# Altium schematic sheet Test_Jig_Pixhawk_DUT.SchDoc
size A2; DrawnBy: Philip Rowse
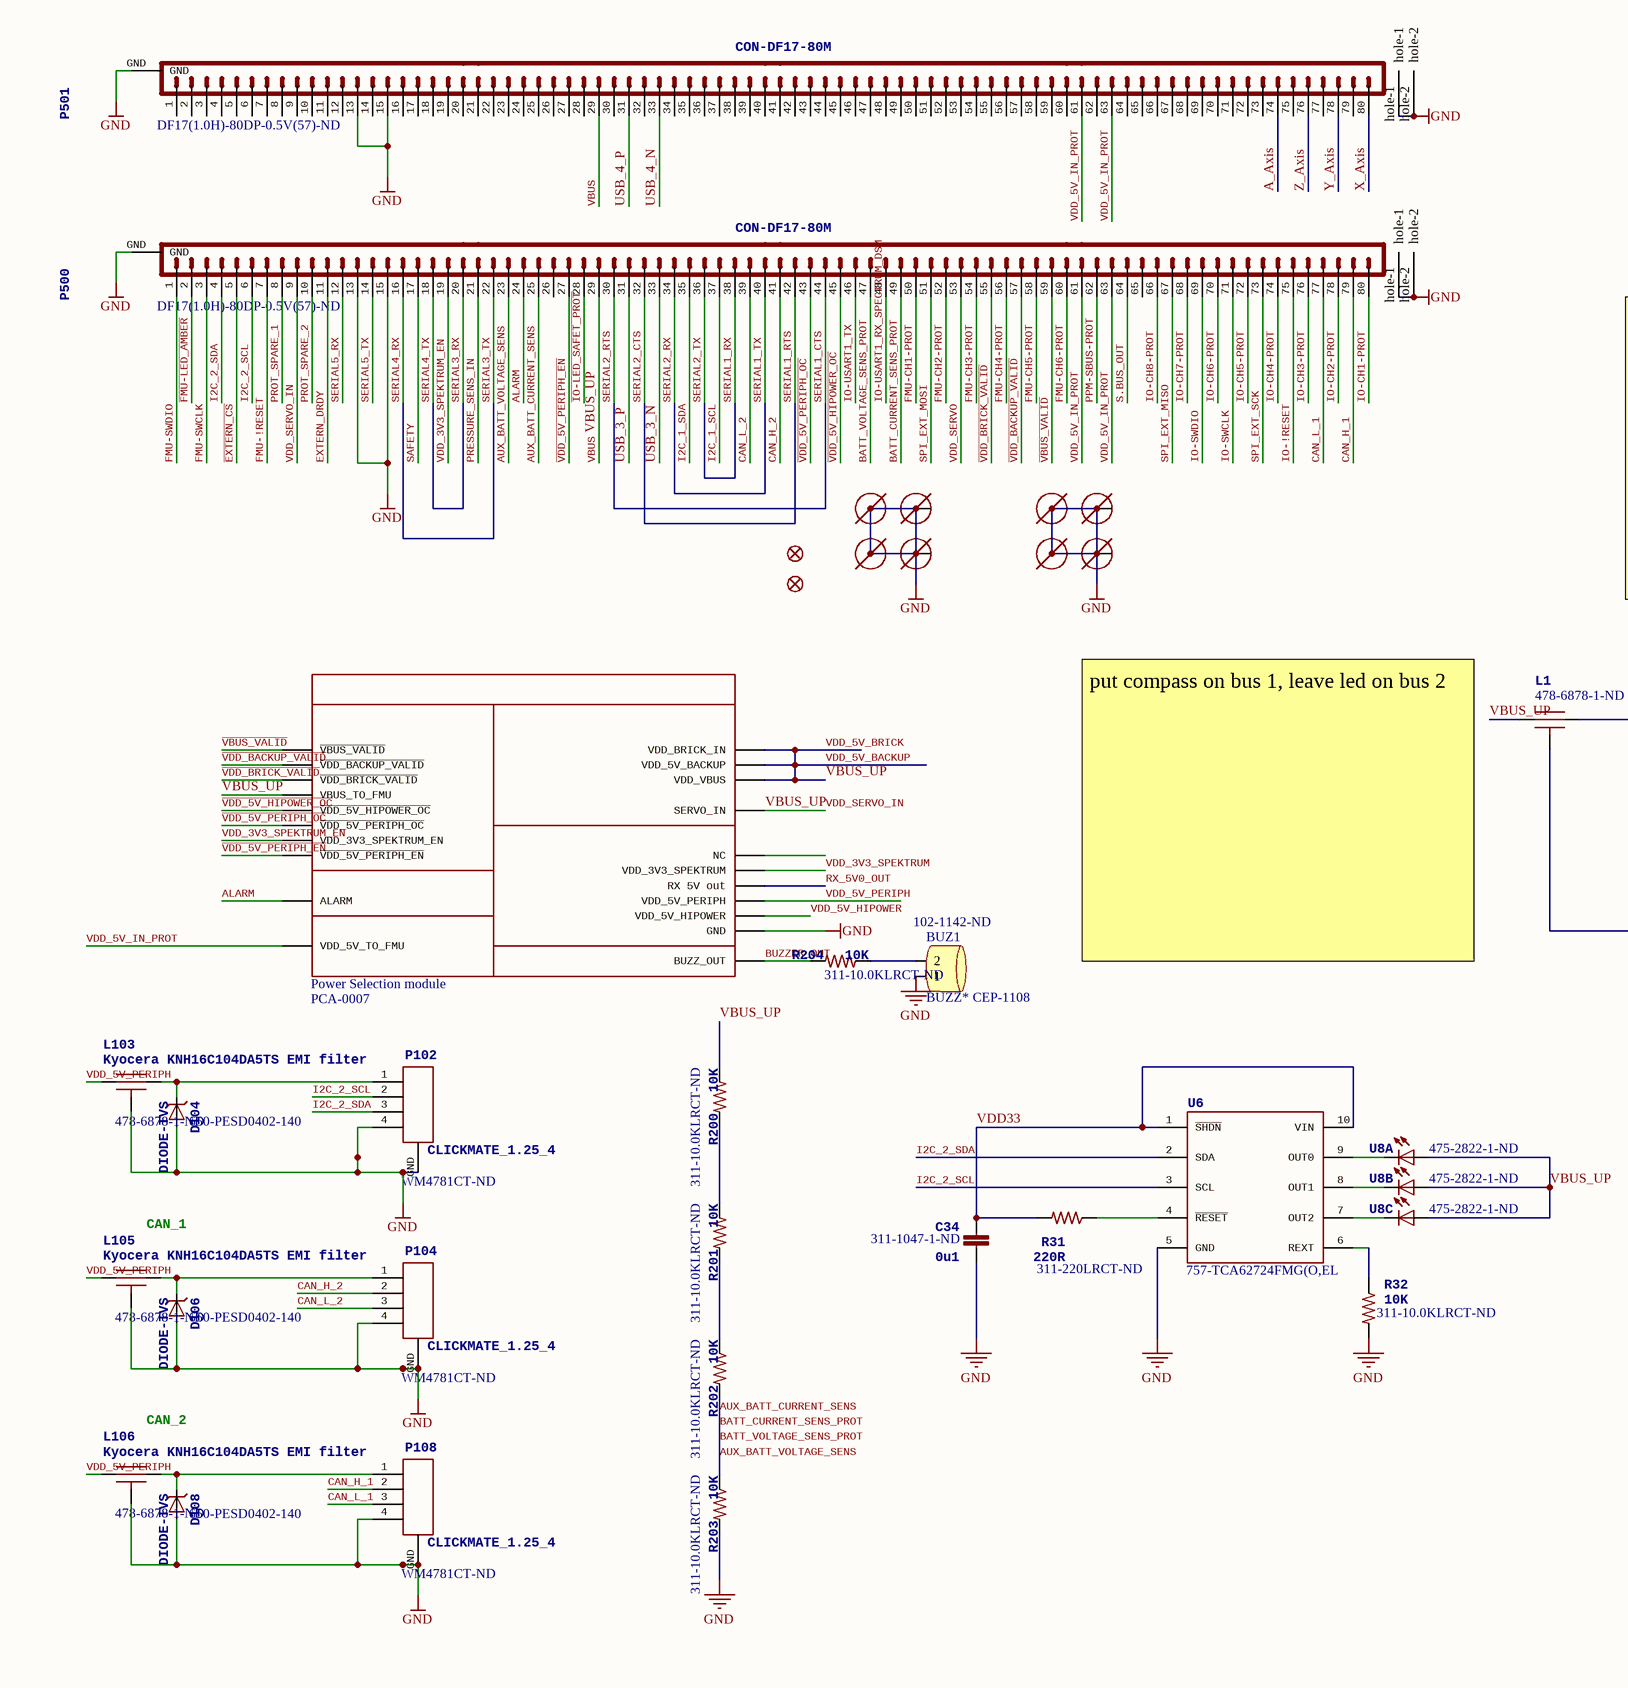
[diagram p0: Test_Jig_Pixhawk_DUT.SchDoc, left]
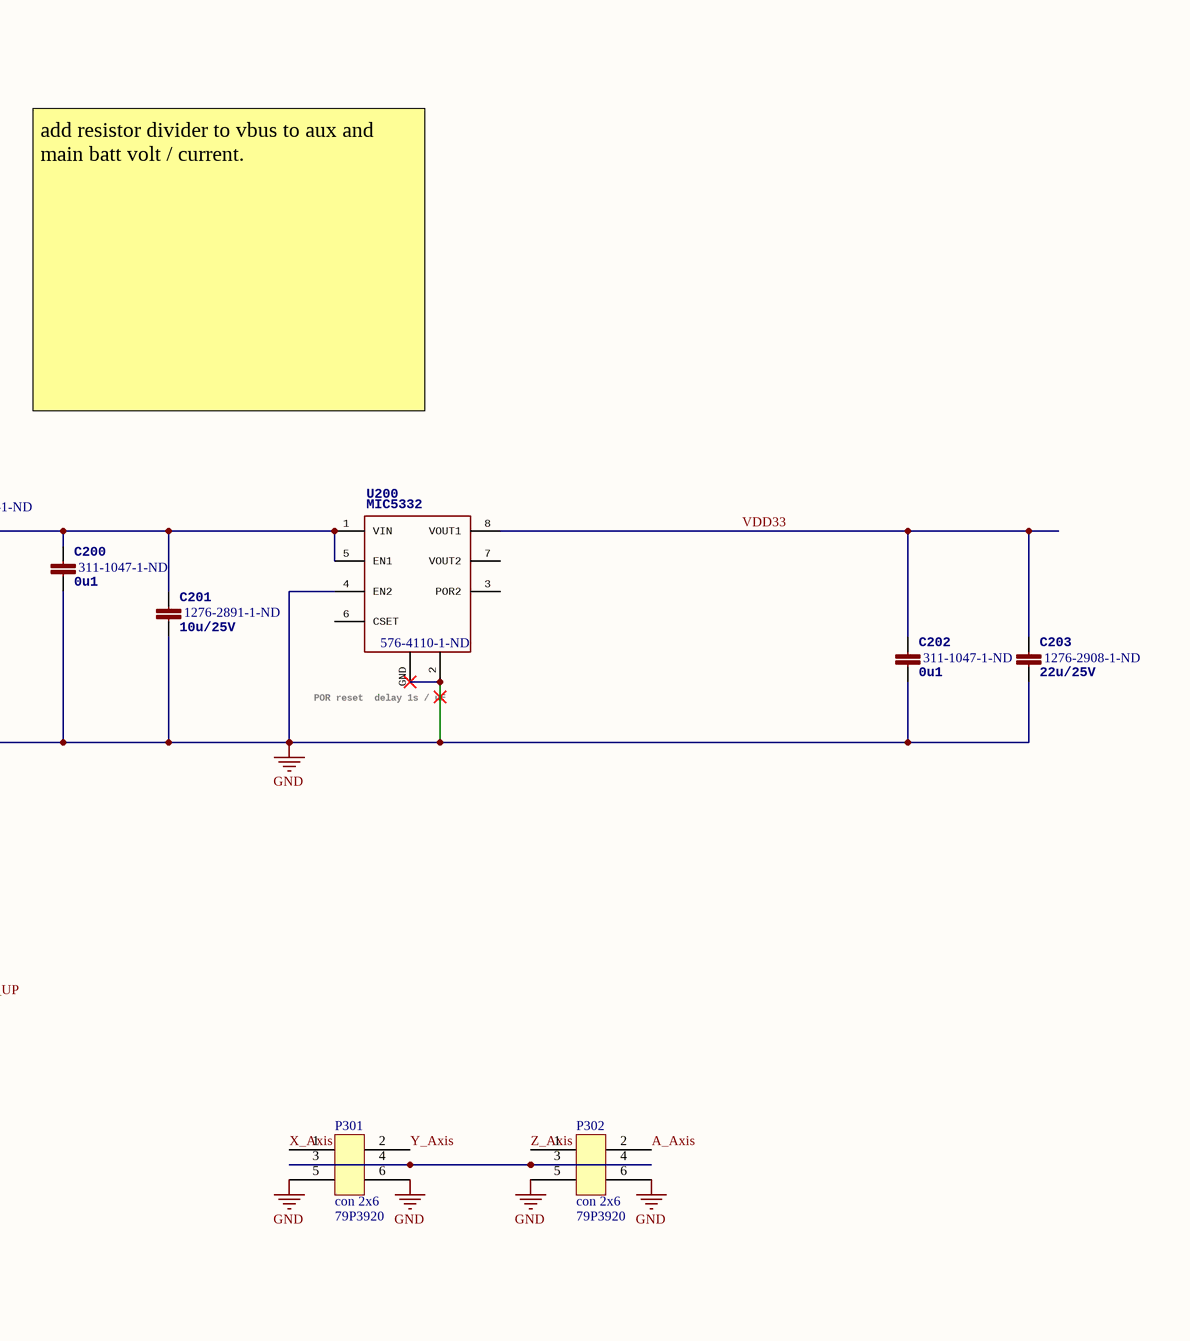
[diagram p1: Test_Jig_Pixhawk_DUT.SchDoc, right]

## Parts
BUZ1  BUZZ* CEP-1108  Supplier Part Number 1: 102-1142-ND  [CEP-1108]
C34  0u1  Supplier Part Number 1: 311-1047-1-ND  [0402-CAP]
C200  0u1  Supplier Part Number 1: 311-1047-1-ND  [0402-CAP]
C201  10u/25V  Supplier Part Number 1: 1276-2891-1-ND  [0805-CAP]
C202  0u1  Supplier Part Number 1: 311-1047-1-ND  [0402-CAP]
C203  22u/25V  Supplier Part Number 1: 1276-2908-1-ND  [0805-CAP]
D104  DIODE-TVS  Supplier Part Number 1: 650-PESD0402-140  [0402-TVS]
D106  DIODE-TVS  Supplier Part Number 1: 650-PESD0402-140  [0402-TVS]
D108  DIODE-TVS  Supplier Part Number 1: 650-PESD0402-140  [0402-TVS]
JP400  FIDUCIAL1.5X3  [FIDUCIAL-1.5X3]  (value not drawn)
JP401  FIDUCIAL1.5X3  [FIDUCIAL-1.5X3]  (value not drawn)
L1  Supplier Part Number 1: 478-6878-1-ND  [KYOCERA-KNH16-DA]  (hidden comment: Kyocera KNH16C104DA5TS EMI filter)
L103  Kyocera KNH16C104DA5TS EMI filter  Supplier Part Number 1: 478-6878-1-ND  [KYOCERA-KNH16-DA]
L105  Kyocera KNH16C104DA5TS EMI filter  Supplier Part Number 1: 478-6878-1-ND  [KYOCERA-KNH16-DA]
L106  Kyocera KNH16C104DA5TS EMI filter  Supplier Part Number 1: 478-6878-1-ND  [KYOCERA-KNH16-DA]
M3_MOUNT901  MOUNT-HOLE1.8MM  [MOUNT-HOLE1.8]  (value not drawn)
M3_MOUNT902  MOUNT-HOLE1.8MM  [MOUNT-HOLE1.8]  (value not drawn)
M3_MOUNT903  MOUNT-HOLE1.8MM  [MOUNT-HOLE1.8]  (value not drawn)
M3_MOUNT904  MOUNT-HOLE1.8MM  [MOUNT-HOLE1.8]  (value not drawn)
M3_MOUNT911  MOUNT-HOLE1.8MM  [MOUNT-HOLE1.8]  (value not drawn)
M3_MOUNT912  MOUNT-HOLE1.8MM  [MOUNT-HOLE1.8]  (value not drawn)
M3_MOUNT913  MOUNT-HOLE1.8MM  [MOUNT-HOLE1.8]  (value not drawn)
M3_MOUNT914  MOUNT-HOLE1.8MM  [MOUNT-HOLE1.8]  (value not drawn)
P102  CLICKMATE_1.25_4  Supplier Part Number 1: WM4781CT-ND  [CLICKMATE_V4]
P104  CLICKMATE_1.25_4  Supplier Part Number 1: WM4781CT-ND  [CLICKMATE_V4]
P108  CLICKMATE_1.25_4  Supplier Part Number 1: WM4781CT-ND  [CLICKMATE_V4]
P301  con 2x6  Supplier Part Number 1: 79P3920  [TSW-103-07-G-D]
P302  con 2x6  Supplier Part Number 1: 79P3920  [TSW-103-07-G-D]
P500  CON-DF17-80M  Supplier Part Number 1: DF17(1.0H)-80DP-0.5V(57)-ND  [CON-DF17-80M]
P501  CON-DF17-80M  Supplier Part Number 1: DF17(1.0H)-80DP-0.5V(57)-ND  [CON-DF17-80M]
PSM200  Power Selection module  Supplier Part Number 1: PCA-0007  [PSM]
R31  220R  Supplier Part Number 1: 311-220LRCT-ND  [0402-RES]
R32  10K  Supplier Part Number 1: 311-10.0KLRCT-ND  [0402-RES]
R200  10K  Supplier Part Number 1: 311-10.0KLRCT-ND  [0402-RES]
R201  10K  Supplier Part Number 1: 311-10.0KLRCT-ND  [0402-RES]
R202  10K  Supplier Part Number 1: 311-10.0KLRCT-ND  [0402-RES]
R203  10K  Supplier Part Number 1: 311-10.0KLRCT-ND  [0402-RES]
R204  10K  Supplier Part Number 1: 311-10.0KLRCT-ND  [0402-RES]
U6  Supplier Part Number 1: 757-TCA62724FMG(O,EL  [SON10]  (hidden comment: TCA62724FMG)
U8  Supplier Part Number 1: 475-2822-1-ND  [6-PLCC]  (hidden comment: LRTB GFTG-T7AW-1+V7A7-29+R5T9-49-L)  (parts A,B,C of 3)
U200  MIC5332  Supplier Part Number 1: 576-4110-1-ND  [MLF-8-EPAD]

## Nets
GND: BUZ1.1 C34.P$1 C200.P$2 C201.P$2 C202.P$2 C203.P$2 D104.A D106.A D108.A L1.GND L103.GND L105.GND L106.GND M3_MOUNT901.1 M3_MOUNT902.1 M3_MOUNT903.1 M3_MOUNT904.1 M3_MOUNT911.1 M3_MOUNT912.1 M3_MOUNT913.1 M3_MOUNT914.1 P102.4 P102.GND P104.4 P104.GND P108.4 P108.GND P301.5 P301.6 P302.5 P302.6 P500.13 P500.15 P500.GND P500.hole-1 P500.hole-2 P501.13 P501.15 P501.GND P501.hole-1 P501.hole-2 PSM200.GND R32.P$2 R203.P$2 U6.5(GND) U200.2(GND) U200.4(EN2) U200.GND
A_Axis: P302.2 P501.74
ALARM: P500.24 PSM200.ALARM
AUX_BATT_CURRENT_SENS: P500.23 P500.25 P500.47 P500.49 R202.P$2 R203.P$1  [also labelled AUX_BATT_VOLTAGE_SENS, BATT_CURRENT_SENS_PROT, BATT_VOLTAGE_SENS_PROT]
BUZZER_OUT: PSM200.BUZZER_OUT(BUZZ_OUT) R204.P$2
CAN_H_1: P108.2 P500.79
CAN_H_2: P104.2 P500.41
CAN_L_1: P108.3 P500.77
CAN_L_2: P104.3 P500.39
~{EXTERN_CS}: P500.5
EXTERN_DRDY: P500.11
~{FMU-LED_AMBER}: P500.2
FMU-!RESET: P500.7
FMU-CH1-PROT: P500.50
FMU-CH2-PROT: P500.52
FMU-CH3-PROT: P500.54
FMU-CH4-PROT: P500.56
FMU-CH5-PROT: P500.58
FMU-CH6-PROT: P500.60
FMU-SWCLK: P500.3
FMU-SWDIO: P500.1
I2C_1_SCL: P500.37
I2C_1_SDA: P500.35
I2C_2_SCL: P102.2 P500.6 U6.3(SCL)
I2C_2_SDA: P102.3 P500.4 U6.2(SDA)
~{IO-LED_SAFET_PROT}: P500.28
IO-!RESET: P500.75
IO-CH1-PROT: P500.80
IO-CH2-PROT: P500.78
IO-CH3-PROT: P500.76
IO-CH4-PROT: P500.74
IO-CH5-PROT: P500.72
IO-CH6-PROT: P500.70
IO-CH7-PROT: P500.68
IO-CH8-PROT: P500.66
IO-SWCLK: P500.71
IO-SWDIO: P500.69
IO-USART1_RX_SPECTRUM_DSM: P500.48
IO-USART1_TX: P500.46
PPM-SBUS-PROT: P500.62
PRESSURE_SENS_IN: P500.21
PROT_SPARE_1: P500.8
PROT_SPARE_2: P500.10
RX_5V0_OUT: PSM200.RX(RX_5V_out)
S.BUS_OUT: P500.64
SAFETY: P500.17
SERIAL1_CTS: P500.30 P500.44  [also labelled SERIAL2_RTS]
SERIAL1_RTS: P500.32 P500.42  [also labelled SERIAL2_CTS]
SERIAL1_RX: P500.36 P500.38  [also labelled SERIAL2_TX]
SERIAL1_TX: P500.34 P500.40  [also labelled SERIAL2_RX]
SERIAL3_RX: P500.18 P500.20  [also labelled SERIAL4_TX]
SERIAL3_TX: P500.16 P500.22  [also labelled SERIAL4_RX]
SERIAL5_RX: P500.12
SERIAL5_TX: P500.14
SPI_EXT_MISO: P500.67
SPI_EXT_MOSI: P500.51
SPI_EXT_SCK: P500.73
USB_3_N: P500.33
USB_3_P: P500.31
USB_4_N: P501.33
USB_4_P: P501.31
~{VBUS_VALID}: P500.59 PSM200.!VBUS_VALID(~{VBUS_VALID})
~{VDD_5V_HIPOWER_OC}: P500.45 PSM200.!VDD_5V_HIPOWER_OC(~{VDD_5V_HIPOWER_OC})
~{VDD_5V_PERIPH_EN}: P500.27 PSM200.!VDD_5V_PERIPH_EN(~{VDD_5V_PERIPH_EN})
~{VDD_5V_PERIPH_OC}: P500.43 PSM200.!VDD_5V_PERIPH_OC(~{VDD_5V_PERIPH_OC})
~{VDD_BACKUP_VALID}: P500.57 PSM200.!VDD_BACKUP_VALID(~{VDD_BACKUP_VALID})
~{VDD_BRICK_VALID}: P500.55 PSM200.!VDD_BRICK_VALID(~{VDD_BRICK_VALID})
VBUS: L1.P$1 P500.9 P500.29 P501.29 PSM200.SERVO_IN PSM200.VBUS(VBUS_TO_FMU) PSM200.VDD_5V_BACKUP PSM200.VDD_BRICK_IN PSM200.VDD_VBUS R200.P$1 U8.A1(A) U8.A2(A) U8.A3(A)  [also labelled VBUS_UP, VDD_5V_BACKUP, VDD_5V_BRICK, VDD_SERVO_IN]
VDD33: C34.P$2 C202.P$1 C203.P$1 R31.P$2 U6.1(~{SHDN}) U6.10(VIN) U200.8(VOUT1)
VDD_3V3_SPEKTRUM: PSM200.SPEK(VDD_3V3_SPEKTRUM)
VDD_3V3_SPEKTRUM_EN: P500.19 PSM200.VDD_3V3_SPEKTRUM_EN
VDD_5V_HIPOWER: PSM200.5V_HIPOWER(VDD_5V_HIPOWER)
VDD_5V_IN_PROT: P500.61 P500.63 P501.61 P501.63 PSM200.VDD_5V_IN_PROT(VDD_5V_TO_FMU)
VDD_5V_PERIPH: L103.P$1 L105.P$1 L106.P$1 PSM200.5V_PERIPH(VDD_5V_PERIPH)
VDD_SERVO: P500.53
X_Axis: P301.1 P501.80
Y_Axis: P301.2 P501.78
Z_Axis: P302.1 P501.76
NetBUZ1_2: BUZ1.2 R204.P$1
NetC200_P$1: C200.P$1 C201.P$1 L1.P$2 U200.1(VIN) U200.5(EN1)
NetD104_C: D104.C L103.P$2 P102.1
NetD106_C: D106.C L105.P$2 P104.1
NetD108_C: D108.C L106.P$2 P108.1
NetP301_3: P301.3 P301.4 P302.3 P302.4
NetR31_P$1: R31.P$1 U6.4(~{RESET})
NetR32_P$1: R32.P$1 U6.6(REXT)
NetR200_P$2: R200.P$2 R201.P$1
NetR201_P$2: R201.P$2 R202.P$1
NetU6_7: U6.7(OUT2) U8.C3(C)
NetU6_8: U6.8(OUT1) U8.C2(C)
NetU6_9: U6.9(OUT0) U8.C1(C)

Not connected (* = marked no-connect by the designer): P500 26 65; P501 1 2 3 4 5 6 7 8 9 10 11 12 14 16 17 18 19 20 21 22 23 24 25 26 27 28 30 32 34 35 36 37 38 39 40 41 42 43 44 45 46 47 48 49 50 51 52 53 54 55 56 57 58 59 60 62 64 65 66 67 68 69 70 71 72 73 75 77 79; PSM200 NC; U200 3(POR2) 6(CSET) 7(VOUT2)

## Notes on the sheet
- add resistor divider to vbus to aux and main batt volt / current.
- (near U200) POR reset
  delay 1s / uF
- put compass on bus 1, leave led on bus 2
- (near L105) CAN_1
- (near L106) CAN_2
- Title
- Size:
- Date:
- File:
- A2
- Number:
- Time:
- Revision:
- Sheet
- of

## Library data of the parts
BUZ1 = BUZZ* CEP-1108: Manufacturer: CUI; Digikey: 102-1142-ND; P/N: CEP-1108; Supplier 1: Digi-Key
C34 = CAP0402: PARTNO: CC0402ZRY5V7BB104; Supplier 1: Digi-Key
C200 C202 = CAP0402: Supplier 1: Digi-Key
C201 C203 = CAP0805: Supplier 1: Digi-Key
D104 D106 D108 = DIODE-TVS: Diode, TVS, 14VWM, 40VC, 0402, SMD; 3DR_PARTNO: ECM0837; Supplier 1: Mouser
JP400 JP401 = FIDUCIAL1.5X3: <b>Fiducial Alignment Points</b> / Various fiducial points for machine vision alignment.; BOM: EXCLUDE; PARTNO: *
L1 = KNH16C104DA5TS: Supplier 1: Digi-Key
L103 L105 L106 = KNH16C104DA5TS: Capacitor, Filter, 0.1uF, 25V, 2A, 0603, SMD; 3DR_PARTNO: ECM0719; Supplier 1: Digi-Key
P102 P104 P108 = CLICKMATE_1.25_4: Connector, Rcpt, 4Pos, 1.25MM, W/B, VERT, SMD, Tin; 3DR_PARTNO: PRT0441; Supplier 1: Digi-Key
P301 P302 = con 2x6: Connector, Header, 6Pos, 2.54MM, Vert, THT, Au; 3DR_PARTNO: PRT0445; Supplier 1: Newark
P500 P501 = CON-DF17-80M: Connector, Header, 80Pos, .5MM, DUAL, SMD, Au; 3DR_PARTNO: PRT0436; Supplier 1: Digi-Key
PSM200 = PSMPSM: PCA, PSM, PX4, Assembly; Manufacturer 1: 3DR; Mfg Part Num (Alternate): DO NOT SWAP; 3DR_PARTNO: PCA0007; Supplier 1: 3DR; Supplier Unit Price 1: 17; Manufacturer Part Number 1: PCA-0007; Supplier Currency 1: USD; Supplier Order Qty 1: 100
R31 = RESISTOR0402-RES: Supplier 1: Digi-Key
R32 = RESISTOR0402-RES: PARTNO: RC0402FR-0710KL; Supplier 1: Digi-Key
R200-R204 = RESISTOR0402-RES: RES 10K OHM 1/16W 1% 0402 SMD; PARTNO: RC0402FR-0710KL; 3DR_PARTNO: ECM0800; Supplier 1: Digi-Key; Value: 10K
U6 = TCA62724FMG: Toshiba TCA62724FMG I2C RGB LED driver; Supplier 1: Mouser
U8 = RGB-LED6-PLCC: RGB LED with separate anode/cathode terminals; Supplier 1: Digi-Key
U200 = MIC5332: Supplier 1: Digi-Key